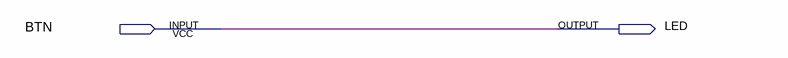
[diagram p0: schematic sheet]
// Quartus schematic QSysTest.bdf as structural Verilog: 0 symbols, 2 pins
module QSysTest (
  input  BTN,
  output LED
);


  assign LED = BTN;
endmodule
